# Altium schematic sheet Audio_Service.SchDoc
size A; Organization: Altium Limited; Address1: L3, 12a Rodborough Rd; Address2: Frenchs Forest; Address3: NSW; Address4: Australia 2086; DocumentNumber: 1; SheetNumber: 1; SheetTotal: 2
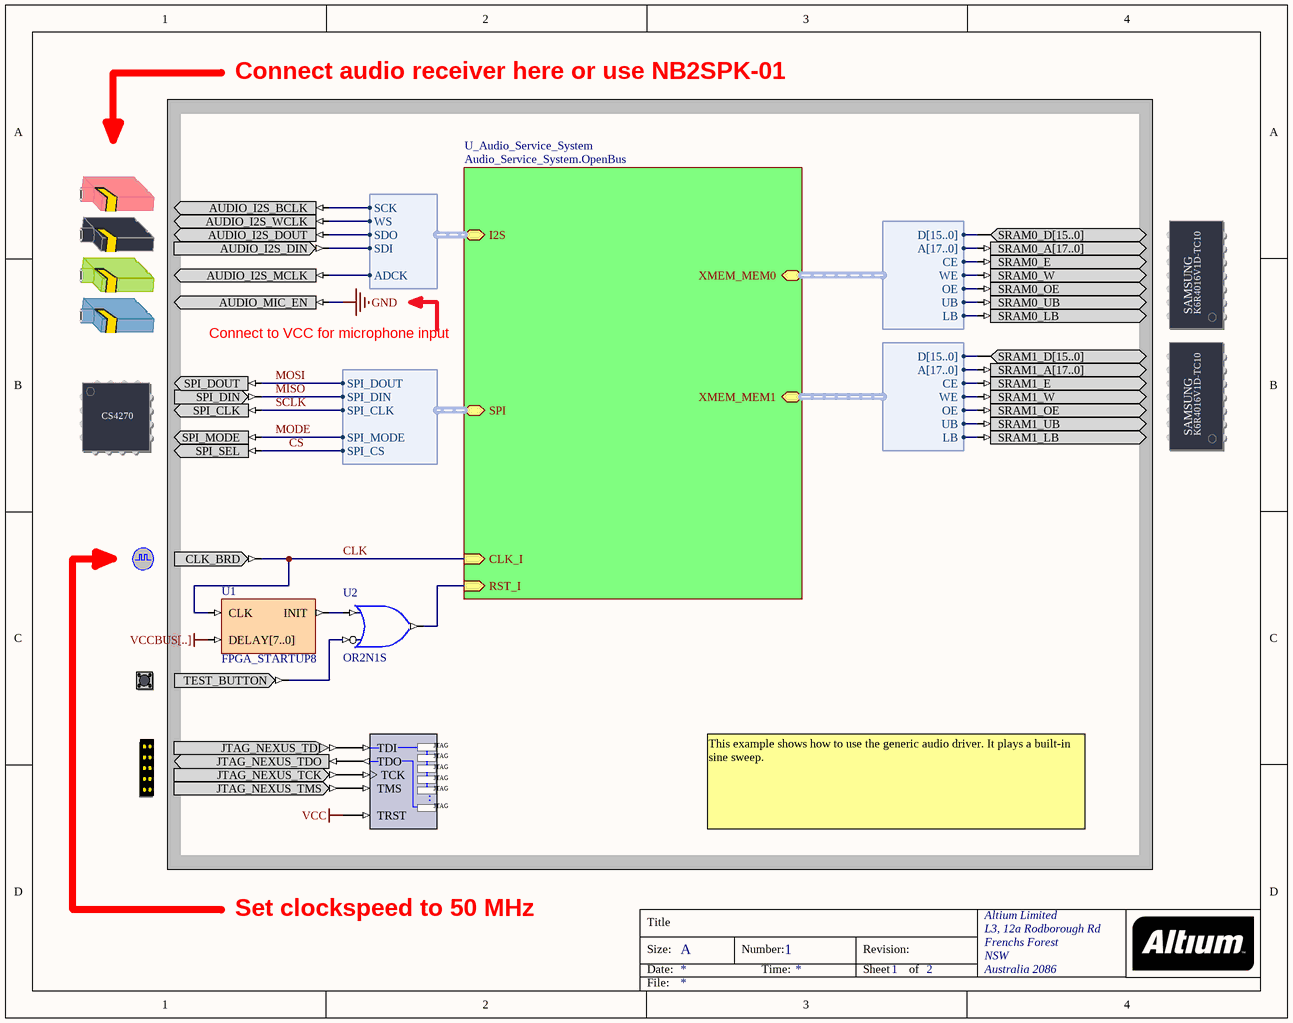
[diagram p0: Audio_Service.SchDoc]

## Parts
(Parts that share a designator on the sheet are numbered #1, #2 ... from top to bottom, then left to right.)
?#1  AUDIO_CODEC  (value not drawn)
?#2  SRAM_DAUGHTER0  (value not drawn)
?#3  SRAM_DAUGHTER1  (value not drawn)
?#4  AUDIO_CODEC_CTRL  (value not drawn)
?#5  CLOCK_BOARD  (value not drawn)
?#6  TEST_BUTTON  (value not drawn)
?#7  NEXUS_JTAG_CONNECTOR  (value not drawn)
NEXUS_JTAG_PORT  NEXUS_JTAG_PORT  (value not drawn)
U1  FPGA_STARTUP8
U2  OR2N1S

## Sub-sheets
U_Audio_Service_System = Audio_Service_System.OpenBus: CLK_I (in), RST_I (in), SPI (harness SPI_W), I2S (harness I2S_W_Both), XMEM_MEM0 (harness WB_MEM_CTRL_SRAM16_A18), XMEM_MEM1 (harness WB_MEM_CTRL_SRAM16_A18)

## Harnesses
SPI_W: SPI_DOUT, SPI_DIN, SPI_CLK, SPI_MODE, SPI_CS
I2S_W_Both: SCK, WS, SDO, SDI, ADCK
WB_MEM_CTRL_SRAM16_A18: D[15..0], A[17..0], CE, WE, OE, UB, LB

## Nets
GND: ?#1.AUDIO_MIC_EN
VCC: NEXUS_JTAG_PORT.TRST
VCCBUS[..]: U1.DELAY[7..0]
CLK: ?#5.CLK_BRD U1.CLK ; sheet U_Audio_Service_System/CLK_I
CS: ?#4.SPI_SEL ; sheet U_Audio_Service_System/SPI.SPI_CS
MISO: ?#4.SPI_DIN ; sheet U_Audio_Service_System/SPI.SPI_DIN
MODE: ?#4.SPI_MODE ; sheet U_Audio_Service_System/SPI.SPI_MODE
MOSI: ?#4.SPI_DOUT ; sheet U_Audio_Service_System/SPI.SPI_DOUT
SCLK: ?#4.SPI_CLK ; sheet U_Audio_Service_System/SPI.SPI_CLK
Net?#1_AUDIO_I2S_BCLK: ?#1.AUDIO_I2S_BCLK ; sheet U_Audio_Service_System/I2S.SCK
Net?#1_AUDIO_I2S_DIN: ?#1.AUDIO_I2S_DIN ; sheet U_Audio_Service_System/I2S.SDI
Net?#1_AUDIO_I2S_DOUT: ?#1.AUDIO_I2S_DOUT ; sheet U_Audio_Service_System/I2S.SDO
Net?#1_AUDIO_I2S_MCLK: ?#1.AUDIO_I2S_MCLK ; sheet U_Audio_Service_System/I2S.ADCK
Net?#1_AUDIO_I2S_WCLK: ?#1.AUDIO_I2S_WCLK ; sheet U_Audio_Service_System/I2S.WS
Net?#2_SRAM0_A[17..0]: ?#2.SRAM0_A[17..0] ; sheet U_Audio_Service_System/XMEM_MEM0.A[17..0]
Net?#2_SRAM0_D[15..0]: ?#2.SRAM0_D[15..0] ; sheet U_Audio_Service_System/XMEM_MEM0.D[15..0]
Net?#2_SRAM0_E: ?#2.SRAM0_E ; sheet U_Audio_Service_System/XMEM_MEM0.CE
Net?#2_SRAM0_LB: ?#2.SRAM0_LB ; sheet U_Audio_Service_System/XMEM_MEM0.LB
Net?#2_SRAM0_OE: ?#2.SRAM0_OE ; sheet U_Audio_Service_System/XMEM_MEM0.OE
Net?#2_SRAM0_UB: ?#2.SRAM0_UB ; sheet U_Audio_Service_System/XMEM_MEM0.UB
Net?#2_SRAM0_W: ?#2.SRAM0_W ; sheet U_Audio_Service_System/XMEM_MEM0.WE
Net?#3_SRAM1_A[17..0]: ?#3.SRAM1_A[17..0] ; sheet U_Audio_Service_System/XMEM_MEM1.A[17..0]
Net?#3_SRAM1_D[15..0]: ?#3.SRAM1_D[15..0] ; sheet U_Audio_Service_System/XMEM_MEM1.D[15..0]
Net?#3_SRAM1_E: ?#3.SRAM1_E ; sheet U_Audio_Service_System/XMEM_MEM1.CE
Net?#3_SRAM1_LB: ?#3.SRAM1_LB ; sheet U_Audio_Service_System/XMEM_MEM1.LB
Net?#3_SRAM1_OE: ?#3.SRAM1_OE ; sheet U_Audio_Service_System/XMEM_MEM1.OE
Net?#3_SRAM1_UB: ?#3.SRAM1_UB ; sheet U_Audio_Service_System/XMEM_MEM1.UB
Net?#3_SRAM1_W: ?#3.SRAM1_W ; sheet U_Audio_Service_System/XMEM_MEM1.WE
Net?#6_TEST_BUTTON: ?#6.TEST_BUTTON U2.I0
Net?#7_JTAG_NEXUS_TCK: ?#7.JTAG_NEXUS_TCK NEXUS_JTAG_PORT.TCK
Net?#7_JTAG_NEXUS_TDI: ?#7.JTAG_NEXUS_TDI NEXUS_JTAG_PORT.TDI
Net?#7_JTAG_NEXUS_TDO: ?#7.JTAG_NEXUS_TDO NEXUS_JTAG_PORT.TDO
Net?#7_JTAG_NEXUS_TMS: ?#7.JTAG_NEXUS_TMS NEXUS_JTAG_PORT.TMS
NetU1_INIT: U1.INIT U2.I1
NetU2_O: U2.O ; sheet U_Audio_Service_System/RST_I

## Notes on the sheet
- Connect audio receiver here or use NB2SPK-01
- Connect to VCC for microphone input
- This example shows how to use the generic audio driver. It plays a built-in sine sweep.
- Set clockspeed to 50 MHz
- Title
- Size:
- Date:
- A
- Number:
- Time:
- Revision:
- Sheet
- of
- File:
- (in symbol AUDIO_CODEC_CTRL) CS4270
- (in symbol NEXUS_JTAG_PORT) .
- (in symbol SRAM_DAUGHTER0) SAMSUNG; K6R4016V1D-TC10
- (in symbol SRAM_DAUGHTER1) SAMSUNG; K6R4016V1D-TC10

## Library data of the parts
?#1 = AUDIO_CODEC: Audio Codec; PortComponent: True; IncludeInDSF: AUDIO_CS4270; Published: 22-Jan-2007; Publisher: Altium Limited; HelpURL: TR0145 Technical Reference for Altium's Audio-Video Peripheral Board PB01.pdf#page=12
?#2 = SRAM_DAUGHTER0: Free Static RAM - Daughterboard; PortComponent: True; Published: 14-May-2007; Publisher: Altium Limited; HelpURL: TR0149 Technical Reference for Altium's Xilinx Spartan-3 Daughter Board DB30.pdf#page=16
?#3 = SRAM_DAUGHTER1: Free Static RAM - Daughterboard; PortComponent: True; Published: 14-May-2007; Publisher: Altium Limited; HelpURL: TR0149 Technical Reference for Altium's Xilinx Spartan-3 Daughter Board DB30.pdf#page=16
?#4 = AUDIO_CODEC_CTRL: Audio Codec Control; PortComponent: True; Published: 22-Jan-2007; Publisher: Altium Limited; HelpURL: TR0145 Technical Reference for Altium's Audio-Video Peripheral Board PB01.pdf#page=13
?#5 = CLOCK_BOARD: Global System Clock Supply; PortComponent: True; Published: 19-Nov-2003; Publisher: Altium Limited; HelpURL: TR0143 Technical Reference Manual for Altium's Desktop NanoBoard NB2DSK01.pdf#page=41; UseInDSF: True
?#6 = TEST_BUTTON: Test / Reset Button; PortComponent: True; Published: 19-Nov-2003; Publisher: Altium Limited; HelpURL: TR0143 Technical Reference Manual for Altium's Desktop NanoBoard NB2DSK01.pdf#page=53
?#7 = NEXUS_JTAG_CONNECTOR: JTAG Port; PortComponent: True; Published: 19-Nov-2003; Publisher: Altium Limited; HelpURL: TR0143 NanoBoard Technical Reference Manual - NB2.pdf#page=48
NEXUS_JTAG_PORT = NEXUS_JTAG_PORT: Soft Nexus-Chain Connector; NEXUS_JTAG_CONNECTOR: True; FunctionalClass: JTAG; Published: 29-Jan-2004; Publisher: Altium Limited; LastRevisionNo: 1.00.00; HelpURL: CR0118 FPGA Generic Library Guide.pdf#page=405
U1 = FPGA_STARTUP8: FPGA Startup With 8 Bit Delay; Published: 9-Dec-2004; Publisher: Altium Limited; HelpURL: CR0119 FPGA_STARTUPx Powerup Delay Unit.pdf; LastRevisionNo: 1.00.00; ComponentLink1Description: Core &Resource Usage; ComponentLink1URL: CR0139 FPGA Peripheral Resource Usage.pdf#page=11
U2 = OR2N1S: 2-Input OR Gate with Active Low A Input, Single Pin Version; XilinxEquivalent: OR2B1; FunctionalClass: Logic Primitive; PortSize: 2; ArchiveName: GENERIC; VHDLIB_SIM: GENERIC_LIB; Published: 29-Jan-2004; Publisher: Altium Limited; LastRevisionNo: 1.00.00; HelpURL: CR0118 FPGA Generic Library Guide.pdf#page=410; ComponentLink1URL: CR0136 FPGA Logic Primitive Resource Usage.pdf#page=187; ComponentLink1Description: Core &Resource Usage; SubClass: OR; PortStyle: Single Pin Version